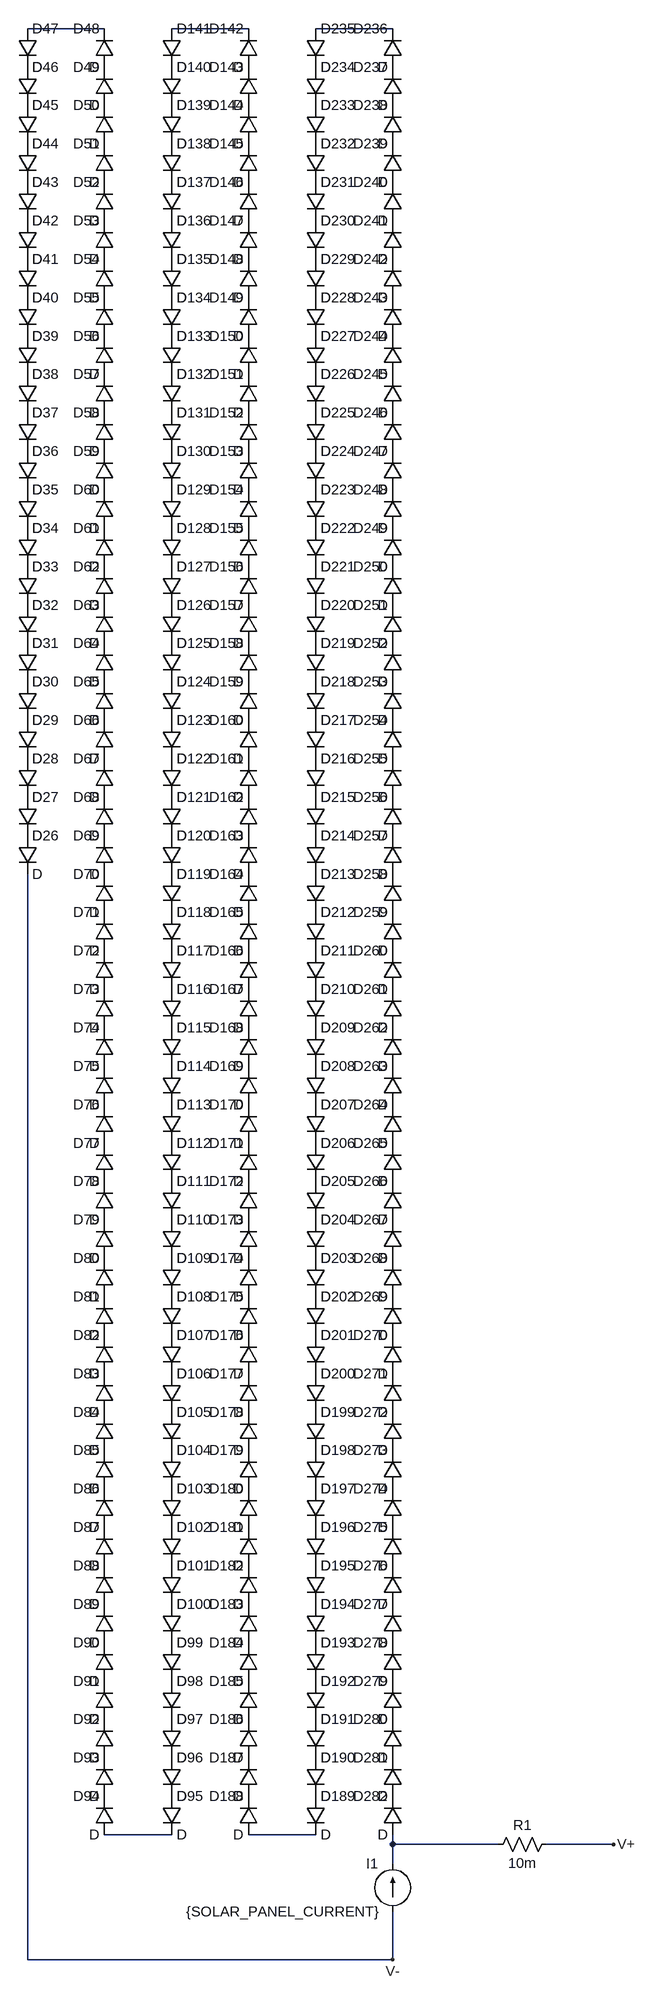
[diagram p0: schematic EC370M-6-120FB_370_Wp.asc]
EC370M-6-120FB_370_Wp.asc, the LTspice schematic file:
Version 4
SHEET 1 1124 680
WIRE 224 -2848 96 -2848
WIRE 464 -2848 336 -2848
WIRE 704 -2848 576 -2848
WIRE 336 160 224 160
WIRE 576 160 464 160
WIRE 704 176 704 160
WIRE 880 176 704 176
WIRE 1072 176 960 176
WIRE 704 208 704 176
WIRE 96 368 96 -1440
WIRE 704 368 704 288
WIRE 704 368 96 368
FLAG 1072 176 V+
FLAG 704 368 V-
SYMBOL current 704 288 R180
WINDOW 0 24 80 Left 2
WINDOW 3 24 0 Left 2
WINDOW 123 0 0 Left 0
WINDOW 39 0 0 Left 0
SYMATTR InstName I1
SYMATTR Value {SOLAR_PANEL_CURRENT}
SYMBOL res 976 160 R90
WINDOW 0 0 56 VBottom 2
WINDOW 3 32 56 VTop 2
SYMATTR InstName R1
SYMATTR Value 10m
SYMBOL diode 80 -1504 R0
SYMATTR InstName D26
SYMBOL diode 80 -1568 R0
SYMATTR InstName D27
SYMBOL diode 80 -1632 R0
SYMATTR InstName D28
SYMBOL diode 80 -1696 R0
SYMATTR InstName D29
SYMBOL diode 80 -1760 R0
SYMATTR InstName D30
SYMBOL diode 80 -1824 R0
SYMATTR InstName D31
SYMBOL diode 80 -1888 R0
SYMATTR InstName D32
SYMBOL diode 80 -1952 R0
SYMATTR InstName D33
SYMBOL diode 80 -2016 R0
SYMATTR InstName D34
SYMBOL diode 80 -2080 R0
SYMATTR InstName D35
SYMBOL diode 80 -2144 R0
SYMATTR InstName D36
SYMBOL diode 80 -2208 R0
SYMATTR InstName D37
SYMBOL diode 80 -2272 R0
SYMATTR InstName D38
SYMBOL diode 80 -2336 R0
SYMATTR InstName D39
SYMBOL diode 80 -2400 R0
SYMATTR InstName D40
SYMBOL diode 80 -2464 R0
SYMATTR InstName D41
SYMBOL diode 80 -2528 R0
SYMATTR InstName D42
SYMBOL diode 80 -2592 R0
SYMATTR InstName D43
SYMBOL diode 80 -2656 R0
SYMATTR InstName D44
SYMBOL diode 80 -2720 R0
SYMATTR InstName D45
SYMBOL diode 80 -2784 R0
SYMATTR InstName D46
SYMBOL diode 80 -2848 R0
SYMATTR InstName D47
SYMBOL diode 240 -2784 R180
WINDOW 0 24 64 Left 2
WINDOW 3 24 0 Left 2
SYMATTR InstName D48
SYMBOL diode 240 -2720 R180
WINDOW 0 24 64 Left 2
WINDOW 3 24 0 Left 2
SYMATTR InstName D49
SYMBOL diode 240 -2656 R180
WINDOW 0 24 64 Left 2
WINDOW 3 24 0 Left 2
SYMATTR InstName D50
SYMBOL diode 240 -2592 R180
WINDOW 0 24 64 Left 2
WINDOW 3 24 0 Left 2
SYMATTR InstName D51
SYMBOL diode 240 -2528 R180
WINDOW 0 24 64 Left 2
WINDOW 3 24 0 Left 2
SYMATTR InstName D52
SYMBOL diode 240 -2464 R180
WINDOW 0 24 64 Left 2
WINDOW 3 24 0 Left 2
SYMATTR InstName D53
SYMBOL diode 240 -2400 R180
WINDOW 0 24 64 Left 2
WINDOW 3 24 0 Left 2
SYMATTR InstName D54
SYMBOL diode 240 -2336 R180
WINDOW 0 24 64 Left 2
WINDOW 3 24 0 Left 2
SYMATTR InstName D55
SYMBOL diode 240 -2272 R180
WINDOW 0 24 64 Left 2
WINDOW 3 24 0 Left 2
SYMATTR InstName D56
SYMBOL diode 240 -2208 R180
WINDOW 0 24 64 Left 2
WINDOW 3 24 0 Left 2
SYMATTR InstName D57
SYMBOL diode 240 -2144 R180
WINDOW 0 24 64 Left 2
WINDOW 3 24 0 Left 2
SYMATTR InstName D58
SYMBOL diode 240 -2080 R180
WINDOW 0 24 64 Left 2
WINDOW 3 24 0 Left 2
SYMATTR InstName D59
SYMBOL diode 240 -2016 R180
WINDOW 0 24 64 Left 2
WINDOW 3 24 0 Left 2
SYMATTR InstName D60
SYMBOL diode 240 -1952 R180
WINDOW 0 24 64 Left 2
WINDOW 3 24 0 Left 2
SYMATTR InstName D61
SYMBOL diode 240 -1888 R180
WINDOW 0 24 64 Left 2
WINDOW 3 24 0 Left 2
SYMATTR InstName D62
SYMBOL diode 240 -1824 R180
WINDOW 0 24 64 Left 2
WINDOW 3 24 0 Left 2
SYMATTR InstName D63
SYMBOL diode 240 -1760 R180
WINDOW 0 24 64 Left 2
WINDOW 3 24 0 Left 2
SYMATTR InstName D64
SYMBOL diode 240 -1696 R180
WINDOW 0 24 64 Left 2
WINDOW 3 24 0 Left 2
SYMATTR InstName D65
SYMBOL diode 240 -1632 R180
WINDOW 0 24 64 Left 2
WINDOW 3 24 0 Left 2
SYMATTR InstName D66
SYMBOL diode 240 -1568 R180
WINDOW 0 24 64 Left 2
WINDOW 3 24 0 Left 2
SYMATTR InstName D67
SYMBOL diode 240 -1504 R180
WINDOW 0 24 64 Left 2
WINDOW 3 24 0 Left 2
SYMATTR InstName D68
SYMBOL diode 240 -1440 R180
WINDOW 0 24 64 Left 2
WINDOW 3 24 0 Left 2
SYMATTR InstName D69
SYMBOL diode 240 -1376 R180
WINDOW 0 24 64 Left 2
WINDOW 3 24 0 Left 2
SYMATTR InstName D70
SYMBOL diode 240 -1312 R180
WINDOW 0 24 64 Left 2
WINDOW 3 24 0 Left 2
SYMATTR InstName D71
SYMBOL diode 240 -1248 R180
WINDOW 0 24 64 Left 2
WINDOW 3 24 0 Left 2
SYMATTR InstName D72
SYMBOL diode 240 -1184 R180
WINDOW 0 24 64 Left 2
WINDOW 3 24 0 Left 2
SYMATTR InstName D73
SYMBOL diode 240 -1120 R180
WINDOW 0 24 64 Left 2
WINDOW 3 24 0 Left 2
SYMATTR InstName D74
SYMBOL diode 240 -1056 R180
WINDOW 0 24 64 Left 2
WINDOW 3 24 0 Left 2
SYMATTR InstName D75
SYMBOL diode 240 -992 R180
WINDOW 0 24 64 Left 2
WINDOW 3 24 0 Left 2
SYMATTR InstName D76
SYMBOL diode 240 -928 R180
WINDOW 0 24 64 Left 2
WINDOW 3 24 0 Left 2
SYMATTR InstName D77
SYMBOL diode 240 -864 R180
WINDOW 0 24 64 Left 2
WINDOW 3 24 0 Left 2
SYMATTR InstName D78
SYMBOL diode 240 -800 R180
WINDOW 0 24 64 Left 2
WINDOW 3 24 0 Left 2
SYMATTR InstName D79
SYMBOL diode 240 -736 R180
WINDOW 0 24 64 Left 2
WINDOW 3 24 0 Left 2
SYMATTR InstName D80
SYMBOL diode 240 -672 R180
WINDOW 0 24 64 Left 2
WINDOW 3 24 0 Left 2
SYMATTR InstName D81
SYMBOL diode 240 -608 R180
WINDOW 0 24 64 Left 2
WINDOW 3 24 0 Left 2
SYMATTR InstName D82
SYMBOL diode 240 -544 R180
WINDOW 0 24 64 Left 2
WINDOW 3 24 0 Left 2
SYMATTR InstName D83
SYMBOL diode 240 -480 R180
WINDOW 0 24 64 Left 2
WINDOW 3 24 0 Left 2
SYMATTR InstName D84
SYMBOL diode 240 -416 R180
WINDOW 0 24 64 Left 2
WINDOW 3 24 0 Left 2
SYMATTR InstName D85
SYMBOL diode 240 -352 R180
WINDOW 0 24 64 Left 2
WINDOW 3 24 0 Left 2
SYMATTR InstName D86
SYMBOL diode 240 -288 R180
WINDOW 0 24 64 Left 2
WINDOW 3 24 0 Left 2
SYMATTR InstName D87
SYMBOL diode 240 -224 R180
WINDOW 0 24 64 Left 2
WINDOW 3 24 0 Left 2
SYMATTR InstName D88
SYMBOL diode 240 -160 R180
WINDOW 0 24 64 Left 2
WINDOW 3 24 0 Left 2
SYMATTR InstName D89
SYMBOL diode 240 -96 R180
WINDOW 0 24 64 Left 2
WINDOW 3 24 0 Left 2
SYMATTR InstName D90
SYMBOL diode 240 -32 R180
WINDOW 0 24 64 Left 2
WINDOW 3 24 0 Left 2
SYMATTR InstName D91
SYMBOL diode 240 32 R180
WINDOW 0 24 64 Left 2
WINDOW 3 24 0 Left 2
SYMATTR InstName D92
SYMBOL diode 240 96 R180
WINDOW 0 24 64 Left 2
WINDOW 3 24 0 Left 2
SYMATTR InstName D93
SYMBOL diode 240 160 R180
WINDOW 0 24 64 Left 2
WINDOW 3 24 0 Left 2
SYMATTR InstName D94
SYMBOL diode 320 96 R0
SYMATTR InstName D95
SYMBOL diode 320 32 R0
SYMATTR InstName D96
SYMBOL diode 320 -32 R0
SYMATTR InstName D97
SYMBOL diode 320 -96 R0
SYMATTR InstName D98
SYMBOL diode 320 -160 R0
SYMATTR InstName D99
SYMBOL diode 320 -224 R0
SYMATTR InstName D100
SYMBOL diode 320 -288 R0
SYMATTR InstName D101
SYMBOL diode 320 -352 R0
SYMATTR InstName D102
SYMBOL diode 320 -416 R0
SYMATTR InstName D103
SYMBOL diode 320 -480 R0
SYMATTR InstName D104
SYMBOL diode 320 -544 R0
SYMATTR InstName D105
SYMBOL diode 320 -608 R0
SYMATTR InstName D106
SYMBOL diode 320 -672 R0
SYMATTR InstName D107
SYMBOL diode 320 -736 R0
SYMATTR InstName D108
SYMBOL diode 320 -800 R0
SYMATTR InstName D109
SYMBOL diode 320 -864 R0
SYMATTR InstName D110
SYMBOL diode 320 -928 R0
SYMATTR InstName D111
SYMBOL diode 320 -992 R0
SYMATTR InstName D112
SYMBOL diode 320 -1056 R0
SYMATTR InstName D113
SYMBOL diode 320 -1120 R0
SYMATTR InstName D114
SYMBOL diode 320 -1184 R0
SYMATTR InstName D115
SYMBOL diode 320 -1248 R0
SYMATTR InstName D116
SYMBOL diode 320 -1312 R0
SYMATTR InstName D117
SYMBOL diode 320 -1376 R0
SYMATTR InstName D118
SYMBOL diode 320 -1440 R0
SYMATTR InstName D119
SYMBOL diode 320 -1504 R0
SYMATTR InstName D120
SYMBOL diode 320 -1568 R0
SYMATTR InstName D121
SYMBOL diode 320 -1632 R0
SYMATTR InstName D122
SYMBOL diode 320 -1696 R0
SYMATTR InstName D123
SYMBOL diode 320 -1760 R0
SYMATTR InstName D124
SYMBOL diode 320 -1824 R0
SYMATTR InstName D125
SYMBOL diode 320 -1888 R0
SYMATTR InstName D126
SYMBOL diode 320 -1952 R0
SYMATTR InstName D127
SYMBOL diode 320 -2016 R0
SYMATTR InstName D128
SYMBOL diode 320 -2080 R0
SYMATTR InstName D129
SYMBOL diode 320 -2144 R0
SYMATTR InstName D130
SYMBOL diode 320 -2208 R0
SYMATTR InstName D131
SYMBOL diode 320 -2272 R0
SYMATTR InstName D132
SYMBOL diode 320 -2336 R0
SYMATTR InstName D133
SYMBOL diode 320 -2400 R0
SYMATTR InstName D134
SYMBOL diode 320 -2464 R0
SYMATTR InstName D135
SYMBOL diode 320 -2528 R0
SYMATTR InstName D136
SYMBOL diode 320 -2592 R0
SYMATTR InstName D137
SYMBOL diode 320 -2656 R0
SYMATTR InstName D138
SYMBOL diode 320 -2720 R0
SYMATTR InstName D139
SYMBOL diode 320 -2784 R0
SYMATTR InstName D140
SYMBOL diode 320 -2848 R0
SYMATTR InstName D141
SYMBOL diode 480 -2784 R180
WINDOW 0 24 64 Left 2
WINDOW 3 24 0 Left 2
SYMATTR InstName D142
SYMBOL diode 480 -2720 R180
WINDOW 0 24 64 Left 2
WINDOW 3 24 0 Left 2
SYMATTR InstName D143
SYMBOL diode 480 -2656 R180
WINDOW 0 24 64 Left 2
WINDOW 3 24 0 Left 2
SYMATTR InstName D144
SYMBOL diode 480 -2592 R180
WINDOW 0 24 64 Left 2
WINDOW 3 24 0 Left 2
SYMATTR InstName D145
SYMBOL diode 480 -2528 R180
WINDOW 0 24 64 Left 2
WINDOW 3 24 0 Left 2
SYMATTR InstName D146
SYMBOL diode 480 -2464 R180
WINDOW 0 24 64 Left 2
WINDOW 3 24 0 Left 2
SYMATTR InstName D147
SYMBOL diode 480 -2400 R180
WINDOW 0 24 64 Left 2
WINDOW 3 24 0 Left 2
SYMATTR InstName D148
SYMBOL diode 480 -2336 R180
WINDOW 0 24 64 Left 2
WINDOW 3 24 0 Left 2
SYMATTR InstName D149
SYMBOL diode 480 -2272 R180
WINDOW 0 24 64 Left 2
WINDOW 3 24 0 Left 2
SYMATTR InstName D150
SYMBOL diode 480 -2208 R180
WINDOW 0 24 64 Left 2
WINDOW 3 24 0 Left 2
SYMATTR InstName D151
SYMBOL diode 480 -2144 R180
WINDOW 0 24 64 Left 2
WINDOW 3 24 0 Left 2
SYMATTR InstName D152
SYMBOL diode 480 -2080 R180
WINDOW 0 24 64 Left 2
WINDOW 3 24 0 Left 2
SYMATTR InstName D153
SYMBOL diode 480 -2016 R180
WINDOW 0 24 64 Left 2
WINDOW 3 24 0 Left 2
SYMATTR InstName D154
SYMBOL diode 480 -1952 R180
WINDOW 0 24 64 Left 2
WINDOW 3 24 0 Left 2
SYMATTR InstName D155
SYMBOL diode 480 -1888 R180
WINDOW 0 24 64 Left 2
WINDOW 3 24 0 Left 2
SYMATTR InstName D156
SYMBOL diode 480 -1824 R180
WINDOW 0 24 64 Left 2
WINDOW 3 24 0 Left 2
SYMATTR InstName D157
SYMBOL diode 480 -1760 R180
WINDOW 0 24 64 Left 2
WINDOW 3 24 0 Left 2
SYMATTR InstName D158
SYMBOL diode 480 -1696 R180
WINDOW 0 24 64 Left 2
WINDOW 3 24 0 Left 2
SYMATTR InstName D159
SYMBOL diode 480 -1632 R180
WINDOW 0 24 64 Left 2
WINDOW 3 24 0 Left 2
SYMATTR InstName D160
SYMBOL diode 480 -1568 R180
WINDOW 0 24 64 Left 2
WINDOW 3 24 0 Left 2
SYMATTR InstName D161
SYMBOL diode 480 -1504 R180
WINDOW 0 24 64 Left 2
WINDOW 3 24 0 Left 2
SYMATTR InstName D162
SYMBOL diode 480 -1440 R180
WINDOW 0 24 64 Left 2
WINDOW 3 24 0 Left 2
SYMATTR InstName D163
SYMBOL diode 480 -1376 R180
WINDOW 0 24 64 Left 2
WINDOW 3 24 0 Left 2
SYMATTR InstName D164
SYMBOL diode 480 -1312 R180
WINDOW 0 24 64 Left 2
WINDOW 3 24 0 Left 2
SYMATTR InstName D165
SYMBOL diode 480 -1248 R180
WINDOW 0 24 64 Left 2
WINDOW 3 24 0 Left 2
SYMATTR InstName D166
SYMBOL diode 480 -1184 R180
WINDOW 0 24 64 Left 2
WINDOW 3 24 0 Left 2
SYMATTR InstName D167
SYMBOL diode 480 -1120 R180
WINDOW 0 24 64 Left 2
WINDOW 3 24 0 Left 2
SYMATTR InstName D168
SYMBOL diode 480 -1056 R180
WINDOW 0 24 64 Left 2
WINDOW 3 24 0 Left 2
SYMATTR InstName D169
SYMBOL diode 480 -992 R180
WINDOW 0 24 64 Left 2
WINDOW 3 24 0 Left 2
SYMATTR InstName D170
SYMBOL diode 480 -928 R180
WINDOW 0 24 64 Left 2
WINDOW 3 24 0 Left 2
SYMATTR InstName D171
SYMBOL diode 480 -864 R180
WINDOW 0 24 64 Left 2
WINDOW 3 24 0 Left 2
SYMATTR InstName D172
SYMBOL diode 480 -800 R180
WINDOW 0 24 64 Left 2
WINDOW 3 24 0 Left 2
SYMATTR InstName D173
SYMBOL diode 480 -736 R180
WINDOW 0 24 64 Left 2
WINDOW 3 24 0 Left 2
SYMATTR InstName D174
SYMBOL diode 480 -672 R180
WINDOW 0 24 64 Left 2
WINDOW 3 24 0 Left 2
SYMATTR InstName D175
SYMBOL diode 480 -608 R180
WINDOW 0 24 64 Left 2
WINDOW 3 24 0 Left 2
SYMATTR InstName D176
SYMBOL diode 480 -544 R180
WINDOW 0 24 64 Left 2
WINDOW 3 24 0 Left 2
SYMATTR InstName D177
SYMBOL diode 480 -480 R180
WINDOW 0 24 64 Left 2
WINDOW 3 24 0 Left 2
SYMATTR InstName D178
SYMBOL diode 480 -416 R180
WINDOW 0 24 64 Left 2
WINDOW 3 24 0 Left 2
SYMATTR InstName D179
SYMBOL diode 480 -352 R180
WINDOW 0 24 64 Left 2
WINDOW 3 24 0 Left 2
SYMATTR InstName D180
SYMBOL diode 480 -288 R180
WINDOW 0 24 64 Left 2
WINDOW 3 24 0 Left 2
SYMATTR InstName D181
SYMBOL diode 480 -224 R180
WINDOW 0 24 64 Left 2
WINDOW 3 24 0 Left 2
SYMATTR InstName D182
SYMBOL diode 480 -160 R180
WINDOW 0 24 64 Left 2
WINDOW 3 24 0 Left 2
SYMATTR InstName D183
SYMBOL diode 480 -96 R180
WINDOW 0 24 64 Left 2
WINDOW 3 24 0 Left 2
SYMATTR InstName D184
SYMBOL diode 480 -32 R180
WINDOW 0 24 64 Left 2
WINDOW 3 24 0 Left 2
SYMATTR InstName D185
SYMBOL diode 480 32 R180
WINDOW 0 24 64 Left 2
WINDOW 3 24 0 Left 2
SYMATTR InstName D186
SYMBOL diode 480 96 R180
WINDOW 0 24 64 Left 2
WINDOW 3 24 0 Left 2
SYMATTR InstName D187
SYMBOL diode 480 160 R180
WINDOW 0 24 64 Left 2
WINDOW 3 24 0 Left 2
SYMATTR InstName D188
SYMBOL diode 560 96 R0
SYMATTR InstName D189
SYMBOL diode 560 32 R0
SYMATTR InstName D190
SYMBOL diode 560 -32 R0
SYMATTR InstName D191
SYMBOL diode 560 -96 R0
SYMATTR InstName D192
SYMBOL diode 560 -160 R0
SYMATTR InstName D193
SYMBOL diode 560 -224 R0
SYMATTR InstName D194
SYMBOL diode 560 -288 R0
SYMATTR InstName D195
SYMBOL diode 560 -352 R0
SYMATTR InstName D196
SYMBOL diode 560 -416 R0
SYMATTR InstName D197
SYMBOL diode 560 -480 R0
SYMATTR InstName D198
SYMBOL diode 560 -544 R0
SYMATTR InstName D199
SYMBOL diode 560 -608 R0
SYMATTR InstName D200
SYMBOL diode 560 -672 R0
SYMATTR InstName D201
SYMBOL diode 560 -736 R0
SYMATTR InstName D202
SYMBOL diode 560 -800 R0
SYMATTR InstName D203
SYMBOL diode 560 -864 R0
SYMATTR InstName D204
SYMBOL diode 560 -928 R0
SYMATTR InstName D205
SYMBOL diode 560 -992 R0
SYMATTR InstName D206
SYMBOL diode 560 -1056 R0
SYMATTR InstName D207
SYMBOL diode 560 -1120 R0
SYMATTR InstName D208
SYMBOL diode 560 -1184 R0
SYMATTR InstName D209
SYMBOL diode 560 -1248 R0
SYMATTR InstName D210
SYMBOL diode 560 -1312 R0
SYMATTR InstName D211
SYMBOL diode 560 -1376 R0
SYMATTR InstName D212
SYMBOL diode 560 -1440 R0
SYMATTR InstName D213
SYMBOL diode 560 -1504 R0
SYMATTR InstName D214
SYMBOL diode 560 -1568 R0
SYMATTR InstName D215
SYMBOL diode 560 -1632 R0
SYMATTR InstName D216
SYMBOL diode 560 -1696 R0
SYMATTR InstName D217
SYMBOL diode 560 -1760 R0
SYMATTR InstName D218
SYMBOL diode 560 -1824 R0
SYMATTR InstName D219
SYMBOL diode 560 -1888 R0
SYMATTR InstName D220
SYMBOL diode 560 -1952 R0
SYMATTR InstName D221
SYMBOL diode 560 -2016 R0
SYMATTR InstName D222
SYMBOL diode 560 -2080 R0
SYMATTR InstName D223
SYMBOL diode 560 -2144 R0
SYMATTR InstName D224
SYMBOL diode 560 -2208 R0
SYMATTR InstName D225
SYMBOL diode 560 -2272 R0
SYMATTR InstName D226
SYMBOL diode 560 -2336 R0
SYMATTR InstName D227
SYMBOL diode 560 -2400 R0
SYMATTR InstName D228
SYMBOL diode 560 -2464 R0
SYMATTR InstName D229
SYMBOL diode 560 -2528 R0
SYMATTR InstName D230
SYMBOL diode 560 -2592 R0
SYMATTR InstName D231
SYMBOL diode 560 -2656 R0
SYMATTR InstName D232
SYMBOL diode 560 -2720 R0
SYMATTR InstName D233
SYMBOL diode 560 -2784 R0
SYMATTR InstName D234
SYMBOL diode 560 -2848 R0
SYMATTR InstName D235
SYMBOL diode 720 -2784 R180
WINDOW 0 24 64 Left 2
WINDOW 3 24 0 Left 2
SYMATTR InstName D236
SYMBOL diode 720 -2720 R180
WINDOW 0 24 64 Left 2
WINDOW 3 24 0 Left 2
SYMATTR InstName D237
SYMBOL diode 720 -2656 R180
WINDOW 0 24 64 Left 2
WINDOW 3 24 0 Left 2
SYMATTR InstName D238
SYMBOL diode 720 -2592 R180
WINDOW 0 24 64 Left 2
WINDOW 3 24 0 Left 2
SYMATTR InstName D239
SYMBOL diode 720 -2528 R180
WINDOW 0 24 64 Left 2
WINDOW 3 24 0 Left 2
SYMATTR InstName D240
SYMBOL diode 720 -2464 R180
WINDOW 0 24 64 Left 2
WINDOW 3 24 0 Left 2
SYMATTR InstName D241
SYMBOL diode 720 -2400 R180
WINDOW 0 24 64 Left 2
WINDOW 3 24 0 Left 2
SYMATTR InstName D242
SYMBOL diode 720 -2336 R180
WINDOW 0 24 64 Left 2
WINDOW 3 24 0 Left 2
SYMATTR InstName D243
SYMBOL diode 720 -2272 R180
WINDOW 0 24 64 Left 2
WINDOW 3 24 0 Left 2
SYMATTR InstName D244
SYMBOL diode 720 -2208 R180
WINDOW 0 24 64 Left 2
WINDOW 3 24 0 Left 2
SYMATTR InstName D245
SYMBOL diode 720 -2144 R180
WINDOW 0 24 64 Left 2
WINDOW 3 24 0 Left 2
SYMATTR InstName D246
SYMBOL diode 720 -2080 R180
WINDOW 0 24 64 Left 2
WINDOW 3 24 0 Left 2
SYMATTR InstName D247
SYMBOL diode 720 -2016 R180
WINDOW 0 24 64 Left 2
WINDOW 3 24 0 Left 2
SYMATTR InstName D248
SYMBOL diode 720 -1952 R180
WINDOW 0 24 64 Left 2
WINDOW 3 24 0 Left 2
SYMATTR InstName D249
SYMBOL diode 720 -1888 R180
WINDOW 0 24 64 Left 2
WINDOW 3 24 0 Left 2
SYMATTR InstName D250
SYMBOL diode 720 -1824 R180
WINDOW 0 24 64 Left 2
WINDOW 3 24 0 Left 2
SYMATTR InstName D251
SYMBOL diode 720 -1760 R180
WINDOW 0 24 64 Left 2
WINDOW 3 24 0 Left 2
SYMATTR InstName D252
SYMBOL diode 720 -1696 R180
WINDOW 0 24 64 Left 2
WINDOW 3 24 0 Left 2
SYMATTR InstName D253
SYMBOL diode 720 -1632 R180
WINDOW 0 24 64 Left 2
WINDOW 3 24 0 Left 2
SYMATTR InstName D254
SYMBOL diode 720 -1568 R180
WINDOW 0 24 64 Left 2
WINDOW 3 24 0 Left 2
SYMATTR InstName D255
SYMBOL diode 720 -1504 R180
WINDOW 0 24 64 Left 2
WINDOW 3 24 0 Left 2
SYMATTR InstName D256
SYMBOL diode 720 -1440 R180
WINDOW 0 24 64 Left 2
WINDOW 3 24 0 Left 2
SYMATTR InstName D257
SYMBOL diode 720 -1376 R180
WINDOW 0 24 64 Left 2
WINDOW 3 24 0 Left 2
SYMATTR InstName D258
SYMBOL diode 720 -1312 R180
WINDOW 0 24 64 Left 2
WINDOW 3 24 0 Left 2
SYMATTR InstName D259
SYMBOL diode 720 -1248 R180
WINDOW 0 24 64 Left 2
WINDOW 3 24 0 Left 2
SYMATTR InstName D260
SYMBOL diode 720 -1184 R180
WINDOW 0 24 64 Left 2
WINDOW 3 24 0 Left 2
SYMATTR InstName D261
SYMBOL diode 720 -1120 R180
WINDOW 0 24 64 Left 2
WINDOW 3 24 0 Left 2
SYMATTR InstName D262
SYMBOL diode 720 -1056 R180
WINDOW 0 24 64 Left 2
WINDOW 3 24 0 Left 2
SYMATTR InstName D263
SYMBOL diode 720 -992 R180
WINDOW 0 24 64 Left 2
WINDOW 3 24 0 Left 2
SYMATTR InstName D264
SYMBOL diode 720 -928 R180
WINDOW 0 24 64 Left 2
WINDOW 3 24 0 Left 2
SYMATTR InstName D265
SYMBOL diode 720 -864 R180
WINDOW 0 24 64 Left 2
WINDOW 3 24 0 Left 2
SYMATTR InstName D266
SYMBOL diode 720 -800 R180
WINDOW 0 24 64 Left 2
WINDOW 3 24 0 Left 2
SYMATTR InstName D267
SYMBOL diode 720 -736 R180
WINDOW 0 24 64 Left 2
WINDOW 3 24 0 Left 2
SYMATTR InstName D268
SYMBOL diode 720 -672 R180
WINDOW 0 24 64 Left 2
WINDOW 3 24 0 Left 2
SYMATTR InstName D269
SYMBOL diode 720 -608 R180
WINDOW 0 24 64 Left 2
WINDOW 3 24 0 Left 2
SYMATTR InstName D270
SYMBOL diode 720 -544 R180
WINDOW 0 24 64 Left 2
WINDOW 3 24 0 Left 2
SYMATTR InstName D271
SYMBOL diode 720 -480 R180
WINDOW 0 24 64 Left 2
WINDOW 3 24 0 Left 2
SYMATTR InstName D272
SYMBOL diode 720 -416 R180
WINDOW 0 24 64 Left 2
WINDOW 3 24 0 Left 2
SYMATTR InstName D273
SYMBOL diode 720 -352 R180
WINDOW 0 24 64 Left 2
WINDOW 3 24 0 Left 2
SYMATTR InstName D274
SYMBOL diode 720 -288 R180
WINDOW 0 24 64 Left 2
WINDOW 3 24 0 Left 2
SYMATTR InstName D275
SYMBOL diode 720 -224 R180
WINDOW 0 24 64 Left 2
WINDOW 3 24 0 Left 2
SYMATTR InstName D276
SYMBOL diode 720 -160 R180
WINDOW 0 24 64 Left 2
WINDOW 3 24 0 Left 2
SYMATTR InstName D277
SYMBOL diode 720 -96 R180
WINDOW 0 24 64 Left 2
WINDOW 3 24 0 Left 2
SYMATTR InstName D278
SYMBOL diode 720 -32 R180
WINDOW 0 24 64 Left 2
WINDOW 3 24 0 Left 2
SYMATTR InstName D279
SYMBOL diode 720 32 R180
WINDOW 0 24 64 Left 2
WINDOW 3 24 0 Left 2
SYMATTR InstName D280
SYMBOL diode 720 96 R180
WINDOW 0 24 64 Left 2
WINDOW 3 24 0 Left 2
SYMATTR InstName D281
SYMBOL diode 720 160 R180
WINDOW 0 24 64 Left 2
WINDOW 3 24 0 Left 2
SYMATTR InstName D282

The netlist it stands for:
* EC370M-6-120FB_370_Wp.asc
I1 V- N006 {SOLAR_PANEL_CURRENT}
R1 V+ N006 10m
D26 P001 V- D
D27 P002 P001 D
D28 P003 P002 D
D29 P004 P003 D
D30 P005 P004 D
D31 P006 P005 D
D32 P007 P006 D
D33 P008 P007 D
D34 P009 P008 D
D35 P010 P009 D
D36 P011 P010 D
D37 P012 P011 D
D38 P013 P012 D
D39 P014 P013 D
D40 P015 P014 D
D41 P016 P015 D
D42 P017 P016 D
D43 P018 P017 D
D44 P019 P018 D
D45 P020 P019 D
D46 P021 P020 D
D47 N001 P021 D
D48 P022 N001 D
D49 P023 P022 D
D50 P024 P023 D
D51 P025 P024 D
D52 P026 P025 D
D53 P027 P026 D
D54 P028 P027 D
D55 P029 P028 D
D56 P030 P029 D
D57 P031 P030 D
D58 P032 P031 D
D59 P033 P032 D
D60 P034 P033 D
D61 P035 P034 D
D62 P036 P035 D
D63 P037 P036 D
D64 P038 P037 D
D65 P039 P038 D
D66 P040 P039 D
D67 P041 P040 D
D68 P042 P041 D
D69 P043 P042 D
D70 P044 P043 D
D71 P045 P044 D
D72 P046 P045 D
D73 P047 P046 D
D74 P048 P047 D
D75 P049 P048 D
D76 P050 P049 D
D77 P051 P050 D
D78 P052 P051 D
D79 P053 P052 D
D80 P054 P053 D
D81 P055 P054 D
D82 P056 P055 D
D83 P057 P056 D
D84 P058 P057 D
D85 P059 P058 D
D86 P060 P059 D
D87 P061 P060 D
D88 P062 P061 D
D89 P063 P062 D
D90 P064 P063 D
D91 P065 P064 D
D92 P066 P065 D
D93 P067 P066 D
D94 N004 P067 D
D95 P068 N004 D
D96 P069 P068 D
D97 P070 P069 D
D98 P071 P070 D
D99 P072 P071 D
D100 P073 P072 D
D101 P074 P073 D
D102 P075 P074 D
D103 P076 P075 D
D104 P077 P076 D
D105 P078 P077 D
D106 P079 P078 D
D107 P080 P079 D
D108 P081 P080 D
D109 P082 P081 D
D110 P083 P082 D
D111 P084 P083 D
D112 P085 P084 D
D113 P086 P085 D
D114 P087 P086 D
D115 P088 P087 D
D116 P089 P088 D
D117 P090 P089 D
D118 P091 P090 D
D119 P092 P091 D
D120 P093 P092 D
D121 P094 P093 D
D122 P095 P094 D
D123 P096 P095 D
D124 P097 P096 D
D125 P098 P097 D
D126 P099 P098 D
D127 P100 P099 D
D128 P101 P100 D
D129 P102 P101 D
D130 P103 P102 D
D131 P104 P103 D
D132 P105 P104 D
D133 P106 P105 D
D134 P107 P106 D
D135 P108 P107 D
D136 P109 P108 D
D137 P110 P109 D
D138 P111 P110 D
D139 P112 P111 D
D140 P113 P112 D
D141 N002 P113 D
D142 P114 N002 D
D143 P115 P114 D
D144 P116 P115 D
D145 P117 P116 D
D146 P118 P117 D
D147 P119 P118 D
D148 P120 P119 D
D149 P121 P120 D
D150 P122 P121 D
D151 P123 P122 D
D152 P124 P123 D
D153 P125 P124 D
D154 P126 P125 D
D155 P127 P126 D
D156 P128 P127 D
D157 P129 P128 D
D158 P130 P129 D
D159 P131 P130 D
D160 P132 P131 D
D161 P133 P132 D
D162 P134 P133 D
D163 P135 P134 D
D164 P136 P135 D
D165 P137 P136 D
D166 P138 P137 D
D167 P139 P138 D
D168 P140 P139 D
D169 P141 P140 D
D170 P142 P141 D
D171 P143 P142 D
D172 P144 P143 D
D173 P145 P144 D
D174 P146 P145 D
D175 P147 P146 D
D176 P148 P147 D
D177 P149 P148 D
D178 P150 P149 D
D179 P151 P150 D
D180 P152 P151 D
D181 P153 P152 D
D182 P154 P153 D
D183 P155 P154 D
D184 P156 P155 D
D185 P157 P156 D
D186 P158 P157 D
D187 P159 P158 D
D188 N005 P159 D
D189 P160 N005 D
D190 P161 P160 D
D191 P162 P161 D
D192 P163 P162 D
D193 P164 P163 D
D194 P165 P164 D
D195 P166 P165 D
D196 P167 P166 D
D197 P168 P167 D
D198 P169 P168 D
D199 P170 P169 D
D200 P171 P170 D
D201 P172 P171 D
D202 P173 P172 D
D203 P174 P173 D
D204 P175 P174 D
D205 P176 P175 D
D206 P177 P176 D
D207 P178 P177 D
D208 P179 P178 D
D209 P180 P179 D
D210 P181 P180 D
D211 P182 P181 D
D212 P183 P182 D
D213 P184 P183 D
D214 P185 P184 D
D215 P186 P185 D
D216 P187 P186 D
D217 P188 P187 D
D218 P189 P188 D
D219 P190 P189 D
D220 P191 P190 D
D221 P192 P191 D
D222 P193 P192 D
D223 P194 P193 D
D224 P195 P194 D
D225 P196 P195 D
D226 P197 P196 D
D227 P198 P197 D
D228 P199 P198 D
D229 P200 P199 D
D230 P201 P200 D
D231 P202 P201 D
D232 P203 P202 D
D233 P204 P203 D
D234 P205 P204 D
D235 N003 P205 D
D236 P206 N003 D
D237 P207 P206 D
D238 P208 P207 D
D239 P209 P208 D
D240 P210 P209 D
D241 P211 P210 D
D242 P212 P211 D
D243 P213 P212 D
D244 P214 P213 D
D245 P215 P214 D
D246 P216 P215 D
D247 P217 P216 D
D248 P218 P217 D
D249 P219 P218 D
D250 P220 P219 D
D251 P221 P220 D
D252 P222 P221 D
D253 P223 P222 D
D254 P224 P223 D
D255 P225 P224 D
D256 P226 P225 D
D257 P227 P226 D
D258 P228 P227 D
D259 P229 P228 D
D260 P230 P229 D
D261 P231 P230 D
D262 P232 P231 D
D263 P233 P232 D
D264 P234 P233 D
D265 P235 P234 D
D266 P236 P235 D
D267 P237 P236 D
D268 P238 P237 D
D269 P239 P238 D
D270 P240 P239 D
D271 P241 P240 D
D272 P242 P241 D
D273 P243 P242 D
D274 P244 P243 D
D275 P245 P244 D
D276 P246 P245 D
D277 P247 P246 D
D278 P248 P247 D
D279 P249 P248 D
D280 P250 P249 D
D281 P251 P250 D
D282 N006 P251 D
.model D D
.lib standard.dio
.backanno
.end